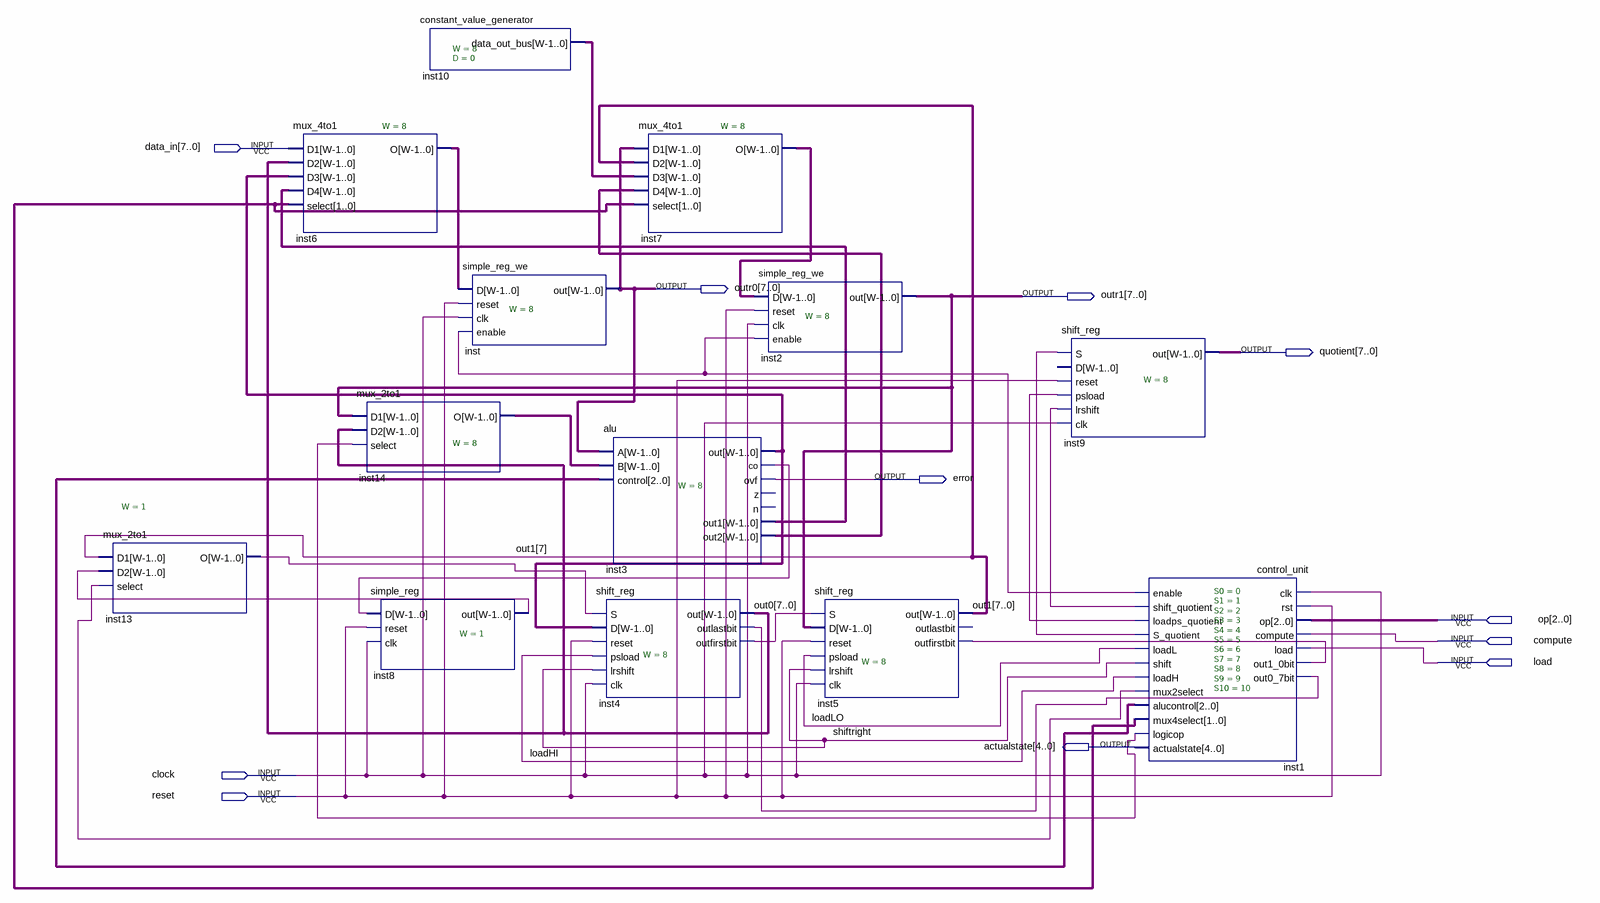
[diagram p0: schematic sheet]
// Quartus schematic deneme.bdf as structural Verilog: 13 symbols, 11 pins
module deneme (
  input  [7:0] data_in,
  input  [2:0] op,
  input  compute,
  input  load,
  input  clock,
  input  reset,
  output [7:0] outr0,
  output [7:0] outr1,
  output [7:0] quotient,
  output error,
  output [4:0] actualstate
);

  wire inst1_enable, inst1_loadps_quotient, inst1_logicop, inst1_mux2select, inst1_s_quotient,
       inst1_shift_quotient, inst3_co, inst4_outfirstbit, inst4_outlastbit, inst5_outfirstbit, inst8_out,
       inst13_o, loadHI, loadLO, shiftright;
  wire [1:0] inst1_mux4select;
  wire [2:0] inst1_alucontrol;
  wire [7:0] inst3_out, inst3_out1, inst3_out2, inst6_o, inst7_o, inst10_data_out_bus, inst14_o, out0, out1;

  mux_2to1 #(.W(1)) inst13 (.D1(out1[7]), .D2(inst8_out), .select(inst1_mux2select), .O(inst13_o));
  mux_4to1 #(.W(8)) inst6 (
    .D1(data_in), .D2(out0), .D3(inst3_out), .D4(inst3_out1), .select(inst1_mux4select), .O(inst6_o));
  mux_2to1 #(.W(8)) inst14 (.D1(outr1), .D2(out0), .select(inst1_logicop), .O(inst14_o));
  simple_reg #(.W(1)) inst8 (.D(inst3_co), .reset(reset), .clk(clock), .out(inst8_out));
  constant_value_generator #(.W(8), .D(0)) inst10 (.data_out_bus(inst10_data_out_bus));
  simple_reg_we #(.W(8)) inst (.D(inst6_o), .reset(reset), .clk(clock), .enable(inst1_enable), .out(outr0));
  alu #(.W(8)) inst3 (
    .A(outr0), .B(inst14_o), .control(inst1_alucontrol), .out(inst3_out), .co(inst3_co), .ovf(error),
    .out1(inst3_out1), .out2(inst3_out2));  // open: z, n
  shift_reg #(.W(8)) inst4 (
    .S(inst13_o), .D(inst3_out), .reset(reset), .psload(loadHI), .lrshift(shiftright), .clk(clock),
    .out(out0), .outlastbit(inst4_outlastbit), .outfirstbit(inst4_outfirstbit));
  mux_4to1 #(.W(8)) inst7 (
    .D1(outr0), .D2(out1), .D3(inst10_data_out_bus), .D4(inst3_out2), .select(inst1_mux4select), .O(inst7_o));
  simple_reg_we #(.W(8)) inst2 (.D(inst7_o), .reset(reset), .clk(clock), .enable(inst1_enable), .out(outr1));
  shift_reg #(.W(8)) inst5 (
    .S(inst4_outfirstbit), .D(outr1), .reset(reset), .psload(loadLO), .lrshift(shiftright), .clk(clock),
    .out(out1), .outfirstbit(inst5_outfirstbit));  // open: outlastbit
  shift_reg #(.W(8)) inst9 (
    .S(inst1_s_quotient), .reset(reset), .psload(inst1_loadps_quotient), .lrshift(inst1_shift_quotient),
    .clk(clock), .out(quotient));  // open: D
  control_unit #(.S0(0), .S1(1), .S2(2), .S3(3), .S4(4), .S5(5), .S6(6), .S7(7), .S8(8), .S9(9), .S10(10)) inst1 (
    .clk(clock), .rst(reset), .op(op), .compute(compute), .load(load), .out1_0bit(inst5_outfirstbit),
    .out0_7bit(inst4_outlastbit), .enable(inst1_enable), .shift_quotient(inst1_shift_quotient),
    .loadps_quotient(inst1_loadps_quotient), .S_quotient(inst1_s_quotient), .loadL(loadLO),
    .shift(shiftright), .loadH(loadHI), .mux2select(inst1_mux2select), .alucontrol(inst1_alucontrol),
    .mux4select(inst1_mux4select), .logicop(inst1_logicop), .actualstate(actualstate));
endmodule
